# Altium project PMS.PrjPcb
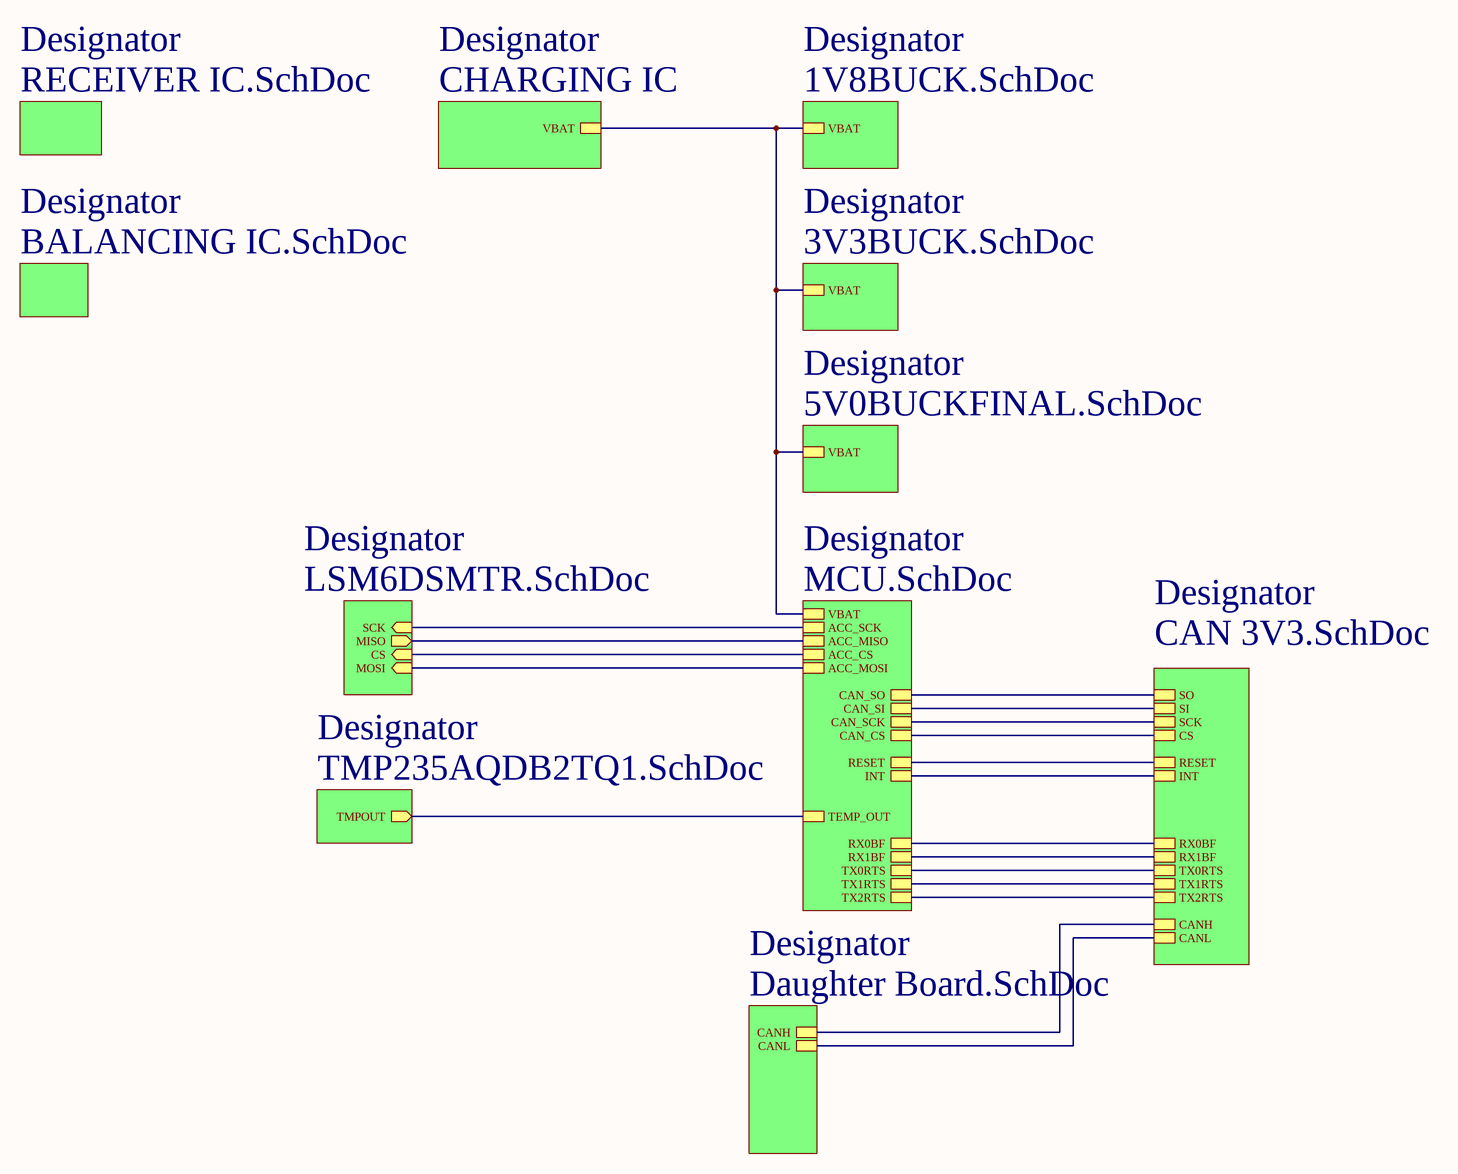
[diagram p0: PMS.SchDoc]
12 sheets, 171 parts. Net scope: hierarchical (ports join the sheet entries above them; power ports are global).
Board file: PMS.PcbDoc
Sheets:
  PMS.SchDoc
    Designator = CHARGING IC.SchDoc
    Designator = BALANCING IC.SchDoc
    Designator = 1V8BUCK.SchDoc
    Designator = 3V3BUCK.SchDoc
    Designator = CAN 3V3.SchDoc
    Designator = RECEIVER IC.SchDoc
    Designator = MCU.SchDoc
    Designator = TMP235AQDB2TQ1.SchDoc
    Designator = LSM6DSMTR.SchDoc
    Designator = 5V0BUCKFINAL.SchDoc
    Designator = Daughter Board.SchDoc

## Sheet PMS.SchDoc
size E

### Sub-sheets
Designator = CHARGING IC: VBAT
Designator = BALANCING IC.SchDoc: no entries
Designator = 1V8BUCK.SchDoc: VBAT
Designator = 3V3BUCK.SchDoc: VBAT
Designator = CAN 3V3.SchDoc: CS, TX2RTS, TX0RTS, TX1RTS, RX0BF, SCK, INT, CANH, RESET, SO, RX1BF, SI, CANL
Designator = RECEIVER IC.SchDoc: no entries
Designator = MCU.SchDoc: CAN_SCK, INT, CAN_CS, ACC_CS, TX2RTS, CAN_SO, TX1RTS, TX0RTS, CAN_SI, ACC_MISO, RX0BF, ACC_SCK, VBAT, ACC_MOSI, TEMP_OUT, RESET, RX1BF
Designator = TMP235AQDB2TQ1.SchDoc: TMPOUT (out)
Designator = LSM6DSMTR.SchDoc: SCK (in), MISO (out), CS (in), MOSI (in)
Designator = 5V0BUCKFINAL.SchDoc: VBAT
Designator = Daughter Board.SchDoc: CANL, CANH

### Nets
NetC41_2: sheet Designator/VBAT, sheet Designator/VBAT, sheet Designator/VBAT, sheet Designator/VBAT, sheet Designator/VBAT
NetC58_2: sheet Designator/CANH, sheet Designator/CANH
NetC67_2: sheet Designator/CANL, sheet Designator/CANL
NetC167_1: sheet Designator/TEMP_OUT, sheet Designator/TMPOUT
NetU7_1: sheet Designator/RESET, sheet Designator/RESET
NetU7_2: sheet Designator/INT, sheet Designator/INT
NetU7_3: sheet Designator/RX0BF, sheet Designator/RX0BF
NetU7_4: sheet Designator/RX1BF, sheet Designator/RX1BF
NetU7_6: sheet Designator/TX0RTS, sheet Designator/TX0RTS
NetU7_7: sheet Designator/TX1RTS, sheet Designator/TX1RTS
NetU7_8: sheet Designator/TX2RTS, sheet Designator/TX2RTS
NetU7_9: sheet Designator/ACC_CS, sheet Designator/CS
NetU7_10: sheet Designator/CS, sheet Designator/CAN_CS
NetU7_18: sheet Designator/SO, sheet Designator/CAN_SO, sheet Designator/ACC_MISO, sheet Designator/MISO
NetU7_19: sheet Designator/SCK, sheet Designator/CAN_SCK, sheet Designator/ACC_SCK, sheet Designator/SCK
NetU7_21: sheet Designator/SI, sheet Designator/CAN_SI, sheet Designator/ACC_MOSI, sheet Designator/MOSI

## Sheet CHARGING IC.SchDoc
size C
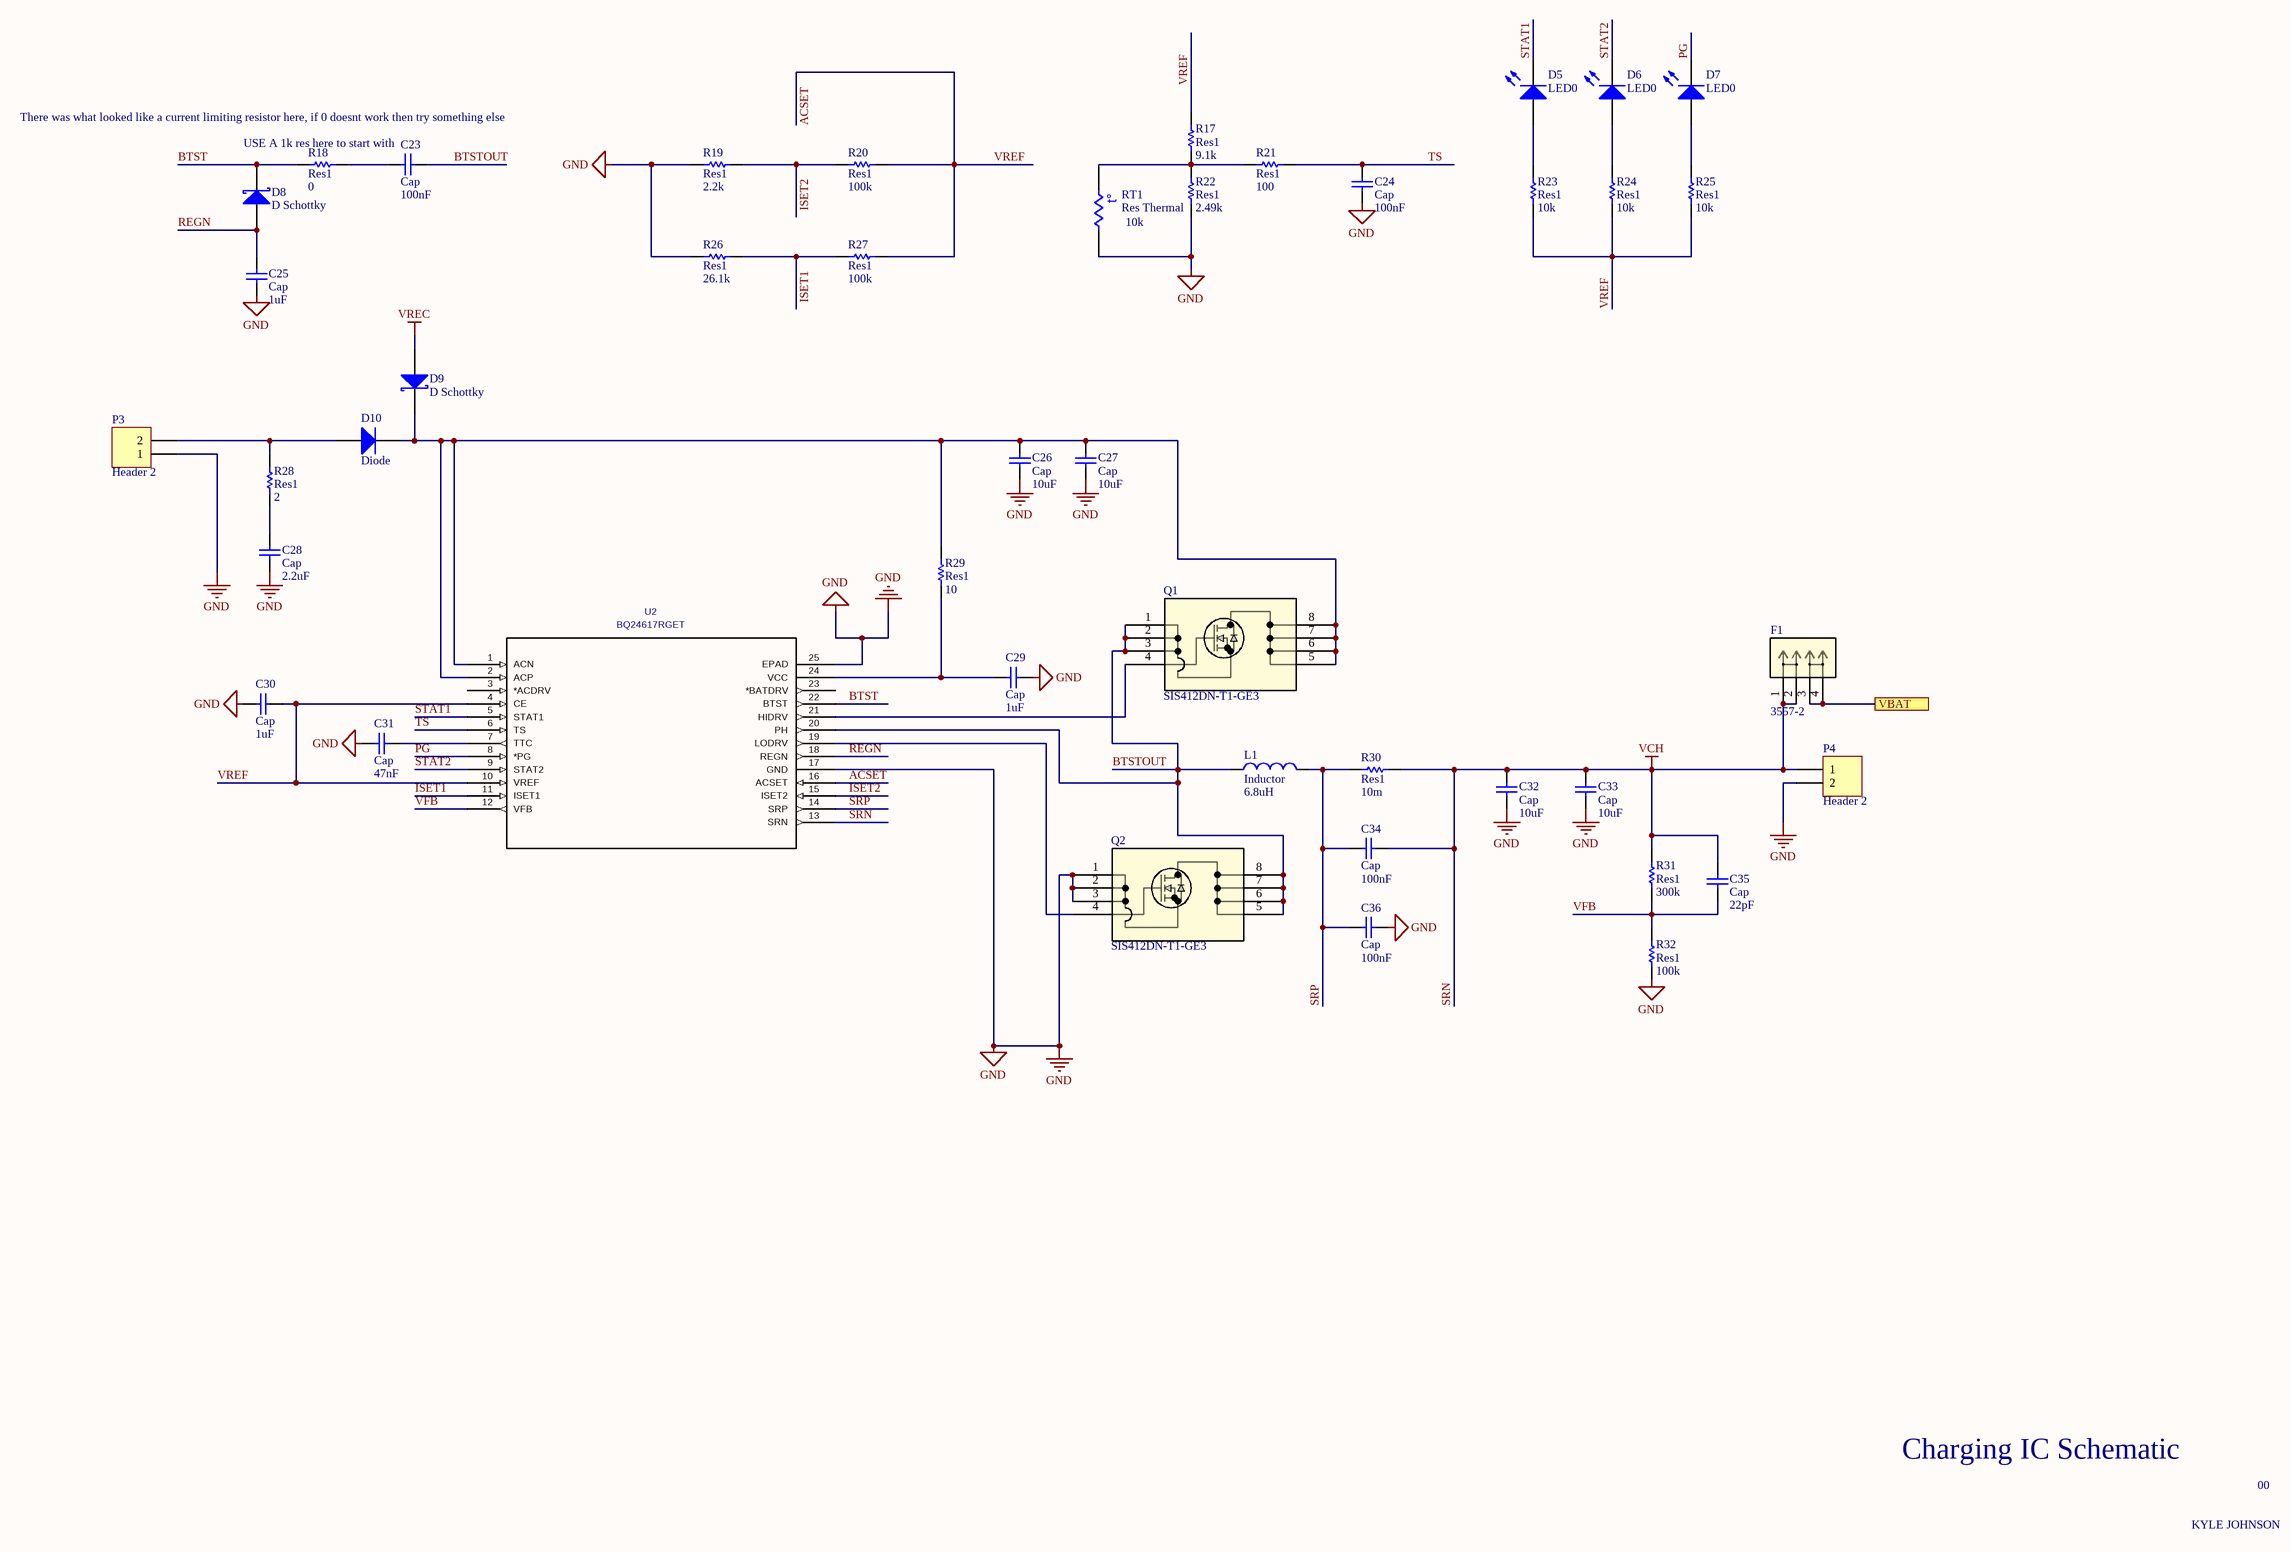
[diagram p1: CHARGING IC.SchDoc]

### Parts
C23  Cap  value 100nF  [0402-A]
C24  Cap  value 100nF  [0402-A]
C25  Cap  value 1uF  [0402-A]
C26  Cap  value 10uF  [6-0805_M]
C27  Cap  value 10uF  [6-0805_M]
C28  Cap  value 2.2uF  [1608[0603]]
C29  Cap  value 1uF  [0402-A]
C30  Cap  value 1uF  [0402-A]
C31  Cap  value 47nF  [0402-A]
C32  Cap  value 10uF  [6-0805_M]
C33  Cap  value 10uF  [6-0805_M]
C34  Cap  value 100nF  [0402-A]
C35  Cap  value 22pF  [0402-A]
C36  Cap  value 100nF  [0402-A]
D5  LED0  [1608[0603]]
D6  LED0  [1608[0603]]
D7  LED0  [1608[0603]]
D8  D Schottky  [425]
D9  D Schottky  [425]
D10  Diode  [X3-WLB1608-2]
F1  3557-2  [CONN_3557-2_KEY]
L1  Inductor  value 6.8uH  [IHLP2525CZER6R8MA1]
P3  Header 2  [2-1445096-2]
P4  Header 2  [2-1445096-2]
Q1  SIS412DN-T1-GE3  [POWERPAK_1212-8]
Q2  SIS412DN-T1-GE3  [POWERPAK_1212-8]
R17  Res1  value 9.1k  [0402-A]
R18  Res1  value 0  [0402-A]
R19  Res1  value 2.2k  [0402-A]
R20  Res1  value 100k  [0402-A]
R21  Res1  value 100  [0402-A]
R22  Res1  value 2.49k  [0402-A]
R23  Res1  value 10k  [0402-A]
R24  Res1  value 10k  [0402-A]
R25  Res1  value 10k  [0402-A]
R26  Res1  value 26.1k  [0402-A]
R27  Res1  value 100k  [0402-A]
R28  Res1  value 2  [6-0805_M]
R29  Res1  value 10  [0402-A]
R30  Res1  value 10m  [6-0805_M]
R31  Res1  value 300k  [0402-A]
R32  Res1  value 100k  [0402-A]
RT1  Res Thermal  value 10k  [1608[0603]]
U2  BQ24617RGET  [RGE24_2P45X2P45]

### Ports
VBAT

### Nets
GND: C24.1 C25.1 C26.1 C27.1 C28.1 C29.2 C30.2 C31.1 C32.1 C33.1 C36.2 P3.1 P4.2 Q2.1(S) Q2.2(S) Q2.3(S) R19.1 R22.1 R26.1 R32.1 RT1.2 U2.17(GND) U2.25(EPAD)
SRN: C32.2 C33.2 C34.1 C35.1 F1.1 F1.2 P4.1 R30.2 R31.2 U2.13(SRN)  [also labelled VCH]
VREC: D9.1(A)
ACSET: C30.1 R17.2 R20.2 R23.1 R24.1 R25.1 R27.2 U2.4(CE) U2.10(VREF) U2.16(ACSET)  [also labelled VREF]
BTST: D8.2(K) R18.1 U2.22(BTST)
BTSTOUT: C23.2 L1.1 Q1.1(S) Q1.2(S) Q1.3(S) Q2.5(D) Q2.6(D) Q2.7(D) Q2.8(D) U2.20(PH)
ISET1: R26.2 R27.1 U2.11(ISET1)
ISET2: R19.2 R20.1 U2.15(ISET2)
PG: D7.2(K) U2.8(*PG)
REGN: C25.2 D8.1(A) U2.18(REGN)
SRP: C34.2 C36.1 L1.2 R30.1 U2.14(SRP)
STAT1: D5.2(K) U2.5(STAT1)
STAT2: D6.2(K) U2.9(STAT2)
TS: C24.2 R21.2 U2.6(TS)
VFB: C35.2 R31.1 R32.2 U2.12(VFB)
NetC23_1: C23.1 R18.2
NetC26_2: C26.2 C27.2 D9.2(K) D10.2(K) Q1.5(D) Q1.6(D) Q1.7(D) Q1.8(D) R29.2 U2.1(ACN) U2.2(ACP)
NetC28_2: C28.2 R28.1
NetC29_1: C29.1 R29.1 U2.24(VCC)
NetC31_2: C31.2 U2.7(TTC)
NetC41_2: F1.3 F1.4 ; port VBAT
NetD5_1: D5.1(A) R23.2
NetD6_1: D6.1(A) R24.2
NetD7_1: D7.1(A) R25.2
NetD10_1: D10.1(A) P3.2 R28.2
NetQ1_4: Q1.4(G) U2.21(HIDRV)
NetQ2_4: Q2.4(G) U2.19(LODRV)
NetR17_1: R17.1 R21.1 R22.2 RT1.1

Not connected (* = marked no-connect by the designer): U2 3(*ACDRV) 23(*BATDRV)

### Notes on the sheet
- There was what looked like a current limiting resistor here, if 0 doesnt work then try something else
- USE A 1k res here to start with
- Charging IC Schematic
- KYLE JOHNSON
- 00
- (in symbol Res Thermal) t°

### Library data of the parts
C23-C36 = Cap: Capacitor; Published: 8-Jun-2000; LatestRevisionDate: 17-Jul-2002; LatestRevisionNote: Re-released for DXP Platform.; PackageReference: RAD-0.3; Publisher: Altium Limited; PackageDescription: Radial Cap, Thru-Hole; 2 Leads; 0.3 in Pin Spacing
D8 D9 = D Schottky: Schottky Diode; Published: 8-Jun-2000; LatestRevisionDate: 17-Jul-2002; LatestRevisionNote: Re-released for DXP Platform.; PackageReference: SMB; Publisher: Altium Limited; PackageDescription: DO-214-AA/SMB; 2 C-Bend Leads; Body 5.3 x 3.6 mm, inc. leads (LxW); Code_JEDEC: DO-214-AA
D10 = Diode: Default Diode; Published: 8-Jun-2000; LatestRevisionDate: 17-Jul-2002; LatestRevisionNote: Re-released for DXP Platform.; PackageVersion: Sep-1996; PackageReference: SMC; Publisher: Altium Limited; PackageDescription: DO-214-AB/SMC; 2 C-Bend Leads; Body 7.9 x 5.9 mm, inc. leads (LxW); Code_JEDEC: DO-214-AB
F1 = 3557-2: No Description Available; Vendor: Keystone Electronics; Built_By: EMA_Cory; SourceLibrary: Keystone Electronics_Complete_2020-01-22; Type: DEV; Manufacturer_Part_Number: 3557-2; Copyright: Copyright (C) 2018 Accelerated Designs. All rights reserved; RefDes: RefDes
L1 = Inductor: Code_IEC: 1005; Published: 8-Jun-2000; LatestRevisionDate: 29-May-2009; LatestRevisionNote: IPC-7351 Footprint Added.; PackageReference: 0402-A; Publisher: Altium Limited; PackageDescription: Chip Inductor; Code_JEITA: 0402
P3 P4 = Header 2: Header, 2-Pin; LatestRevisionDate: 17-Jul-2002; LatestRevisionNote: Re-released for DXP Platform.; Publisher: Altium Limited
Q1 Q2 = SIS412DN-T1-GE3: No Description Available; Vendor: Vishay; Built_By: EMA_Cory; Type: DEV; Datasheet: https://www.vishay.com/docs/69006/sis412dn.pdf; Manufacturer_Part_Number: SIS412DN-T1-GE3; Copyright: Copyright (C) 2018 Accelerated Designs. All rights reserved; RefDes: RefDes
R17-R32 = Res1: Resistor; Published: 8-Jun-2000; LatestRevisionDate: 17-Jul-2002; LatestRevisionNote: Re-released for DXP Platform.; PackageReference: AXIAL-0.3; Publisher: Altium Limited; PackageDescription: Axial Device, Thru-Hole; 2 Leads; 0.3 in Pin Spacing
RT1 = Res Thermal: Thermistor; Published: 24-Mar-1999; LatestRevisionDate: 29-May-2009; LatestRevisionNote: IPC-7351 Footprint Added.; PackageVersion: Mar-2003; PackageReference: 6-0805; Publisher: Altium Limited; PackageDescription: Chip Resistor 0805 Case Size; Code_IPC: RESC2012
U2 = BQ24617RGET: Manufacturer: Texas Instruments; C: Copyright (C) 2015 Accelerated Designs. All rights reserved; Built_By: EMA_UL_Team; Value: BQ24617RGET; Vendor: Vendor; Manufacturer_Part_Number: BQ24617RGET
D5-D7 = LED0: Published: 8-Jun-2000; LatestRevisionDate: 08-Jul-2005; LatestRevisionNote: Mech Layer 1 removed.; PackageReference: LED-0; Publisher: Altium Limited; PackageDescription: LED; 2 Leads

## Sheet BALANCING IC.SchDoc
size A
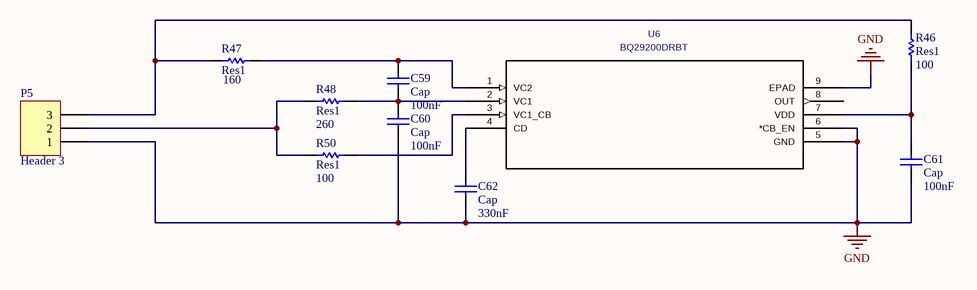
[diagram p2: BALANCING IC.SchDoc]

### Parts
C59  Cap  value 100nF  [0402-A]
C60  Cap  value 100nF  [0402-A]
C61  Cap  value 100nF  [0402-A]
C62  Cap  value 330nF  [6-0805_M]
P5  Header 3  [conn3_2-1445050-3_TEC]
R46  Res1  value 100  [0402-A]
R47  Res1  value 160  [0402-A]
R48  Res1  value 260  [0402-A]
R50  Res1  value 100  [0402-A]
U6  BQ29200DRBT  [DRB8_1P6X2P4]

### Nets
GND: C60.1 C61.2 C62.1 P5.1 U6.5(GND) U6.6(*CB_EN) U6.9(EPAD)
NetC59_1: C59.1 R47.2 U6.1(VC2)
NetC59_2: C59.2 C60.2 R48.2 U6.2(VC1)
NetC61_1: C61.1 R46.2 U6.7(VDD)
NetC62_2: C62.2 U6.4(CD)
NetP5_2: P5.2 R48.1 R50.1
NetP5_3: P5.3 R46.1 R47.1
NetR50_2: R50.2 U6.3(VC1_CB)

Not connected (* = marked no-connect by the designer): U6 8(OUT)

### Library data of the parts
C59-C62 = Cap: Capacitor; Published: 8-Jun-2000; LatestRevisionDate: 17-Jul-2002; LatestRevisionNote: Re-released for DXP Platform.; PackageReference: RAD-0.3; Publisher: Altium Limited; PackageDescription: Radial Cap, Thru-Hole; 2 Leads; 0.3 in Pin Spacing
P5 = Header 3: Header, 3-Pin; LatestRevisionDate: 17-Jul-2002; LatestRevisionNote: Re-released for DXP Platform.; Publisher: Altium Limited
R46-R48 R50 = Res1: Resistor; Published: 8-Jun-2000; LatestRevisionDate: 17-Jul-2002; LatestRevisionNote: Re-released for DXP Platform.; PackageReference: AXIAL-0.3; Publisher: Altium Limited; PackageDescription: Axial Device, Thru-Hole; 2 Leads; 0.3 in Pin Spacing
U6 = BQ29200DRBT: Manufacturer: Texas Instruments; C: Copyright (C) 2015 Accelerated Designs. All rights reserved; Built_By: EMA_UL_Team; Value: BQ29200DRBT; Vendor: Vendor; Manufacturer_Part_Number: BQ29200DRBT

## Sheet 1V8BUCK.SchDoc
size A
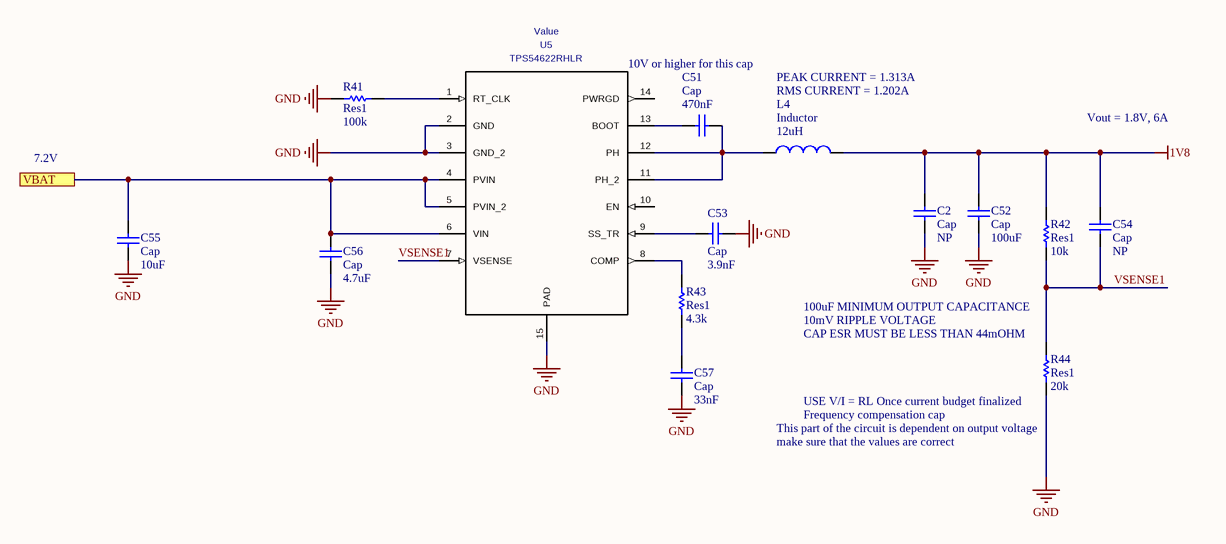
[diagram p3: 1V8BUCK.SchDoc]

### Parts
C2  Cap  value NP  [1608[0603]]
C51  Cap  value 470nF  [0402-A]
C52  Cap  value 100uF  [C1210]
C53  Cap  value 3.9nF  [0402-A]
C54  Cap  value NP  [1608[0603]]
C55  Cap  value 10uF  [6-0805_M]
C56  Cap  value 4.7uF  [6-0805_M]
C57  Cap  value 33nF  [0402-A]
L4  Inductor  value 12uH  [IND_BOURNS_SRR1260]
R41  Res1  value 100k  [0402-A]
R42  Res1  value 10k  [0402-A]
R43  Res1  value 4.3k  [0402-A]
R44  Res1  value 20k  [0402-A]
U5  TPS54622RHLR  [RHL0014A]

### Ports
VBAT

### Nets
1V8: C2.2 C52.2 C54.2 L4.2 R42.1
GND: C2.1 C52.1 C53.1 C55.1 C56.1 C57.1 R41.1 R44.1 U5.2(GND) U5.3(GND_2) U5.15(PAD)
VSENSE1: C54.1 R42.2 R44.2 U5.7(VSENSE)
NetC41_2: C55.2 C56.2 U5.4(PVIN) U5.5(PVIN_2) U5.6(VIN) ; port VBAT
NetC51_1: C51.1 U5.13(BOOT)
NetC51_2: C51.2 L4.1 U5.11(PH_2) U5.12(PH)
NetC53_2: C53.2 U5.9(SS_TR)
NetC57_2: C57.2 R43.1
NetR41_2: R41.2 U5.1(RT_CLK)
NetR43_2: R43.2 U5.8(COMP)

Not connected (* = marked no-connect by the designer): U5 10(EN) 14(PWRGD)

### Notes on the sheet
- (near U5) 10V or higher for this cap
- PEAK CURRENT = 1.313A
- RMS CURRENT = 1.202A
- Vout = 1.8V, 6A
- 7.2V
- 100uF MINIMUM OUTPUT CAPACITANCE
- 10mV RIPPLE VOLTAGE
- (near R44) CAP ESR MUST BE LESS THAN 44mOHM
- (near R44) USE V/I = RL Once current budget finalized
- Frequency compensation cap
- (near R44) This part of the circuit is dependent on output voltage
- make sure that the values are correct

### Library data of the parts
C2 C51-C57 = Cap: Capacitor; Published: 8-Jun-2000; LatestRevisionDate: 17-Jul-2002; LatestRevisionNote: Re-released for DXP Platform.; PackageReference: RAD-0.3; Publisher: Altium Limited; PackageDescription: Radial Cap, Thru-Hole; 2 Leads; 0.3 in Pin Spacing
L4 = Inductor: Code_IEC: 1005; Published: 8-Jun-2000; LatestRevisionDate: 29-May-2009; LatestRevisionNote: IPC-7351 Footprint Added.; PackageReference: 0402-A; Publisher: Altium Limited; PackageDescription: Chip Inductor; Code_JEITA: 0402
R41-R44 = Res1: Resistor; Published: 8-Jun-2000; LatestRevisionDate: 17-Jul-2002; LatestRevisionNote: Re-released for DXP Platform.; PackageReference: AXIAL-0.3; Publisher: Altium Limited; PackageDescription: Axial Device, Thru-Hole; 2 Leads; 0.3 in Pin Spacing
U5 = TPS54622RHLR: Manufacturer: Texas Instruments; CompType: IC; PIN_COUNT: 15; PartNumber: TPS54622RHLR; PackageReference: RHL0014A; MountType: SMT; RoHS: Y; Value: Value

## Sheet 3V3BUCK.SchDoc
size A
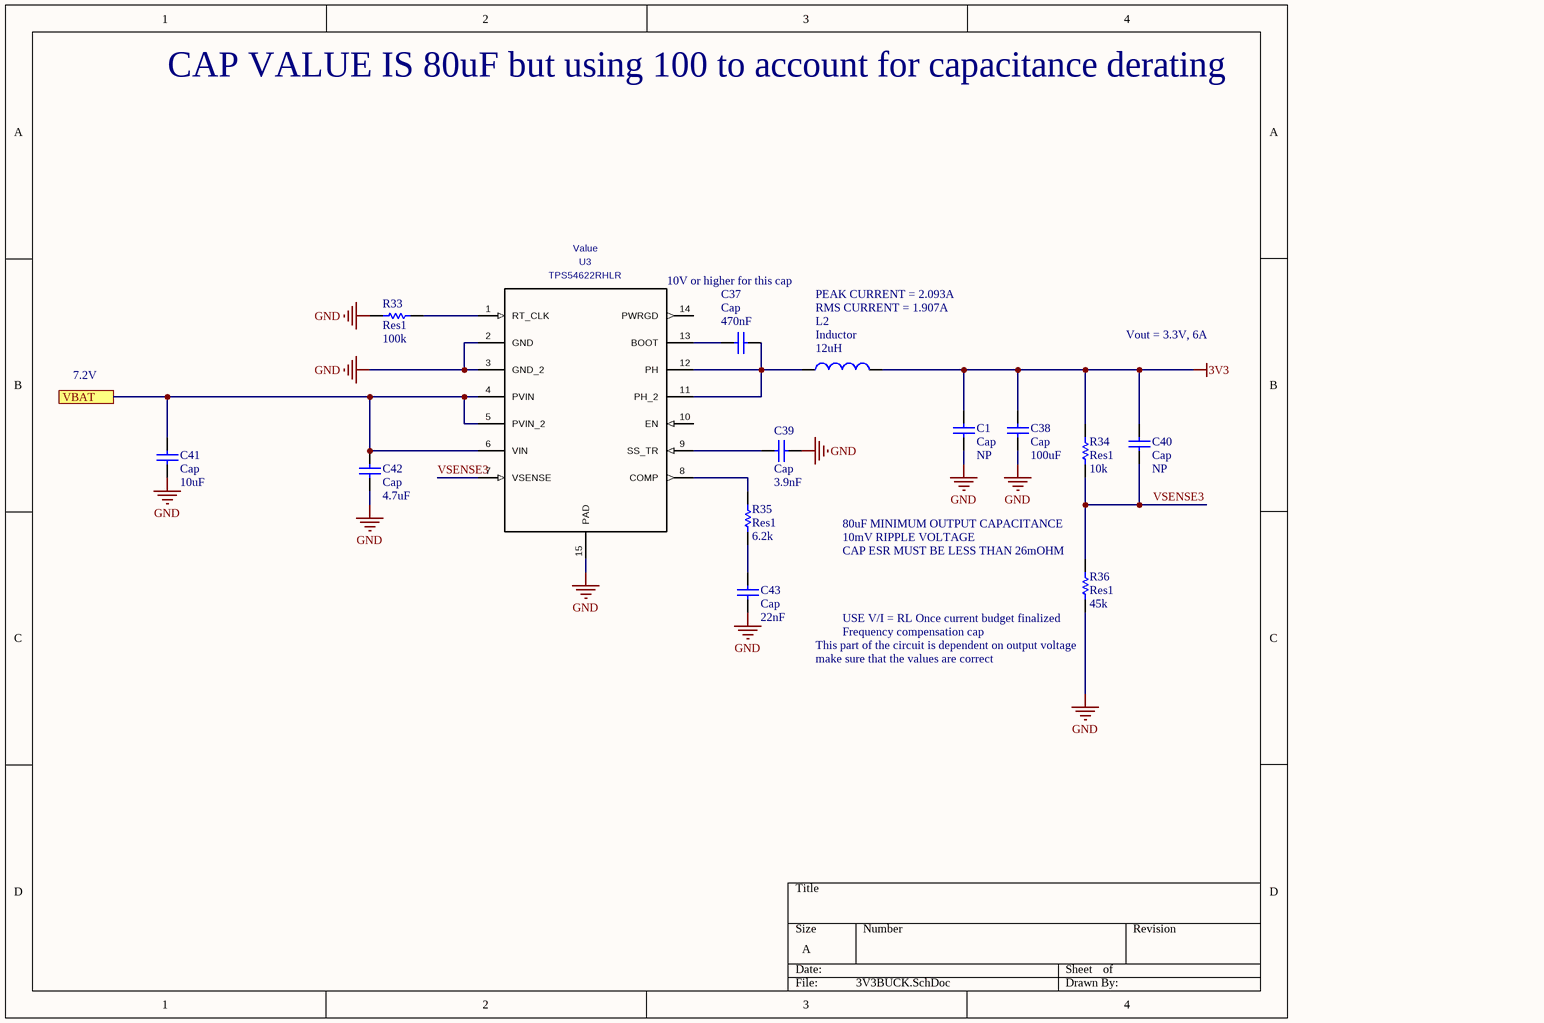
[diagram p4: 3V3BUCK.SchDoc]

### Parts
C1  Cap  value NP  [1608[0603]]
C37  Cap  value 470nF  [0402-A]
C38  Cap  value 100uF  [C1210]
C39  Cap  value 3.9nF  [0402-A]
C40  Cap  value NP  [1608[0603]]
C41  Cap  value 10uF  [6-0805_M]
C42  Cap  value 4.7uF  [6-0805_M]
C43  Cap  value 22nF  [0402-A]
L2  Inductor  value 12uH  [IND_BOURNS_SRR1260]
R33  Res1  value 100k  [0402-A]
R34  Res1  value 10k  [0402-A]
R35  Res1  value 6.2k  [0402-A]
R36  Res1  value 45k  [0402-A]
U3  TPS54622RHLR  [RHL0014A]

### Ports
VBAT

### Nets
3V3: C1.2 C38.2 C40.2 L2.2 R34.1
GND: C1.1 C38.1 C39.1 C41.1 C42.1 C43.1 R33.1 R36.1 U3.2(GND) U3.3(GND_2) U3.15(PAD)
VSENSE3: C40.1 R34.2 R36.2 U3.7(VSENSE)
NetC37_1: C37.1 U3.13(BOOT)
NetC37_2: C37.2 L2.1 U3.11(PH_2) U3.12(PH)
NetC39_2: C39.2 U3.9(SS_TR)
NetC41_2: C41.2 C42.2 U3.4(PVIN) U3.5(PVIN_2) U3.6(VIN) ; port VBAT
NetC43_2: C43.2 R35.1
NetR33_2: R33.2 U3.1(RT_CLK)
NetR35_2: R35.2 U3.8(COMP)

Not connected (* = marked no-connect by the designer): U3 10(EN) 14(PWRGD)

### Notes on the sheet
- CAP VALUE IS 80uF but using 100 to account for capacitance derating
- (near U3) 10V or higher for this cap
- PEAK CURRENT = 2.093A
- RMS CURRENT = 1.907A
- Vout = 3.3V, 6A
- 7.2V
- 80uF MINIMUM OUTPUT CAPACITANCE
- 10mV RIPPLE VOLTAGE
- (near R36) CAP ESR MUST BE LESS THAN 26mOHM
- (near R36) USE V/I = RL Once current budget finalized
- Frequency compensation cap
- (near R36) This part of the circuit is dependent on output voltage
- make sure that the values are correct

### Library data of the parts
C1 C37-C43 = Cap: Capacitor; Published: 8-Jun-2000; LatestRevisionDate: 17-Jul-2002; LatestRevisionNote: Re-released for DXP Platform.; PackageReference: RAD-0.3; Publisher: Altium Limited; PackageDescription: Radial Cap, Thru-Hole; 2 Leads; 0.3 in Pin Spacing
L2 = Inductor: Code_IEC: 1005; Published: 8-Jun-2000; LatestRevisionDate: 29-May-2009; LatestRevisionNote: IPC-7351 Footprint Added.; PackageReference: 0402-A; Publisher: Altium Limited; PackageDescription: Chip Inductor; Code_JEITA: 0402
R33-R35 = Res1: Resistor; Published: 8-Jun-2000; LatestRevisionDate: 17-Jul-2002; LatestRevisionNote: Re-released for DXP Platform.; PackageReference: AXIAL-0.3; Publisher: Altium Limited; PackageDescription: Axial Device, Thru-Hole; 2 Leads; 0.3 in Pin Spacing
R36 = Res1: Resistor 1%; Published: 8-Jun-2000; LatestRevisionDate: 17-Jul-2002; LatestRevisionNote: Re-released for DXP Platform.; PackageReference: AXIAL-0.3; Publisher: Altium Limited; PackageDescription: Axial Device, Thru-Hole; 2 Leads; 0.3 in Pin Spacing
U3 = TPS54622RHLR: as U5 on sheet 1V8BUCK; PartNumber: TPS54622RHLR; PackageReference: RHL0014A; MountType: SMT; RoHS: Y; Value: Value

## Sheet CAN 3V3.SchDoc
size A
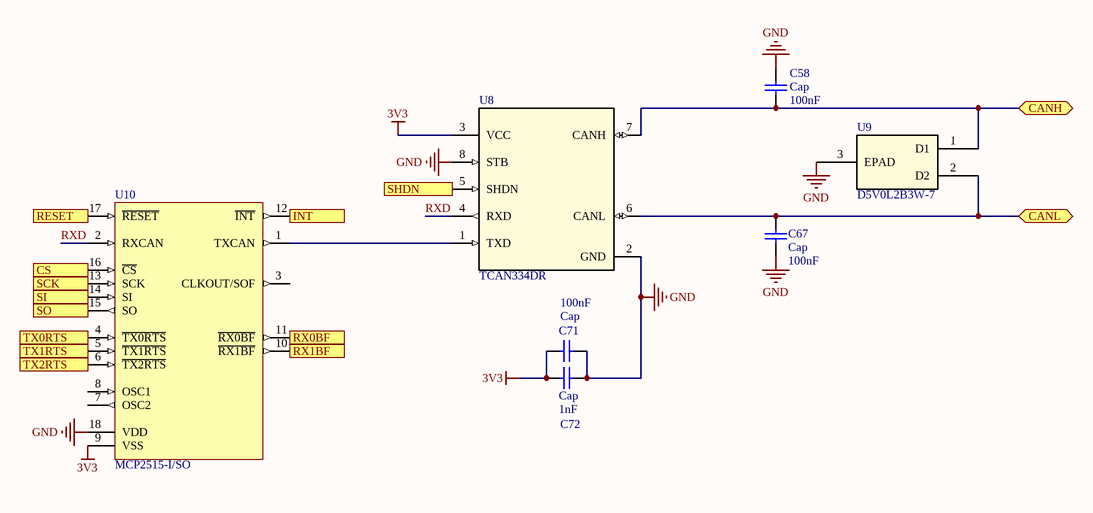
[diagram p5: CAN 3V3.SchDoc]

### Parts
C58  Cap  value 100nF  [1608[0603]]
C67  Cap  value 100nF  [1608[0603]]
C71  Cap  value 100nF  [1608[0603]]
C72  Cap  value 1nF  [1608[0603]]
U8  TCAN334DR  [D0008A_N]
U9  D5V0L2B3W-7  [SOT-323_DIO]
U10  MCP2515-I/SO  [SOIC-SO18_L]

### Ports
CANH (bidir), CANL (bidir), CS (in), INT (out), RESET (in), RX0BF (out), RX1BF (out), SCK (in), SHDN (in), SI (in), SO (out), TX0RTS (in), TX1RTS (in), TX2RTS (in)

### Nets
3V3: C71.1 C72.2 U8.3(VCC) U10.9(VSS)
GND: C58.1 C67.1 C71.2 C72.1 U8.2(GND) U8.8(STB) U9.3(EPAD) U10.18(VDD)
RXD: U8.4(RXD) U10.2(RXCAN)
NetC58_2: C58.2 U8.7(CANH) U9.1(D1) ; port CANH
NetC67_2: C67.2 U8.6(CANL) U9.2(D2) ; port CANL
NetU7_1: U10.17(~{RESET}) ; port RESET
NetU7_2: U10.12(~{INT}) ; port INT
NetU7_3: U10.11(~{RX0BF}) ; port RX0BF
NetU7_4: U10.10(~{RX1BF}) ; port RX1BF
NetU7_6: U10.4(~{TX0RTS}) ; port TX0RTS
NetU7_7: U10.5(~{TX1RTS}) ; port TX1RTS
NetU7_8: U10.6(~{TX2RTS}) ; port TX2RTS
NetU7_10: U10.16(~{CS}) ; port CS
NetU7_18: U10.15(SO) ; port SO
NetU7_19: U10.13(SCK) ; port SCK
NetU7_21: U10.14(SI) ; port SI
NetU8_1: U8.1(TXD) U10.1(TXCAN)
NetU8_5: U8.5(SHDN) ; port SHDN

Not connected (* = marked no-connect by the designer): U10 3(CLKOUT/SOF) 7(OSC2) 8(OSC1)

### Library data of the parts
C58 C67 C71 C72 = Cap: Capacitor; Published: 8-Jun-2000; LatestRevisionDate: 17-Jul-2002; LatestRevisionNote: Re-released for DXP Platform.; PackageReference: RAD-0.3; Publisher: Altium Limited; PackageDescription: Radial Cap, Thru-Hole; 2 Leads; 0.3 in Pin Spacing
U8 = TCAN334DR: No Description Available; Manufacturer: Texas Instruments; PartNumber: TCAN334DR; RefDes: RefDes; Type: DEV; Value: Value; Copyright: Copyright (C) 2018 Accelerated Designs. All rights reserved
U9 = D5V0L2B3W-7: No Description Available; Vendor: Diodes Inc; Built_By: EMA_UL_Team; SourceLibrary: DIODESINC_2_2015-08-18; Manufacturer_Part_Number: D5V0L2B3W-7; Copyright: Copyright (C) 2018 Accelerated Designs. All rights reserved; RefDes: RefDes; Type: DEV
U10 = CMP-0186-00133-2: Stand-Alone CAN Controller With SPI Interface, 18-Pin SOIC, Industrial Temperature; ComponentLink2Description: Datasheet; RevisionNote: URLs added. DatasheetVersion updated.; PackageVersion: revBB, Aug-2009; ComponentLink1URL: http://www.microchip.com/; PackageReference: SOIC-SO18; PackageDescription: 18-Lead Plastic Small Outline (SO) - Wide 7.50mm Body [SOIC]; DatasheetVersion: revF, Oct-2010; ComponentLink2URL: http://ww1.microchip.com/downloads/en/DeviceDoc/21801f.pdf; ComponentLink3URL: http://www.microchip.com/stellent/groups/techpub_sg/documents/packagingspec/en012702.pdf; Code_JEDEC: MS-013; ComponentLink3Description: Package Specification; ComponentLink1Description: Manufacturer URL

## Sheet RECEIVER IC.SchDoc
size D
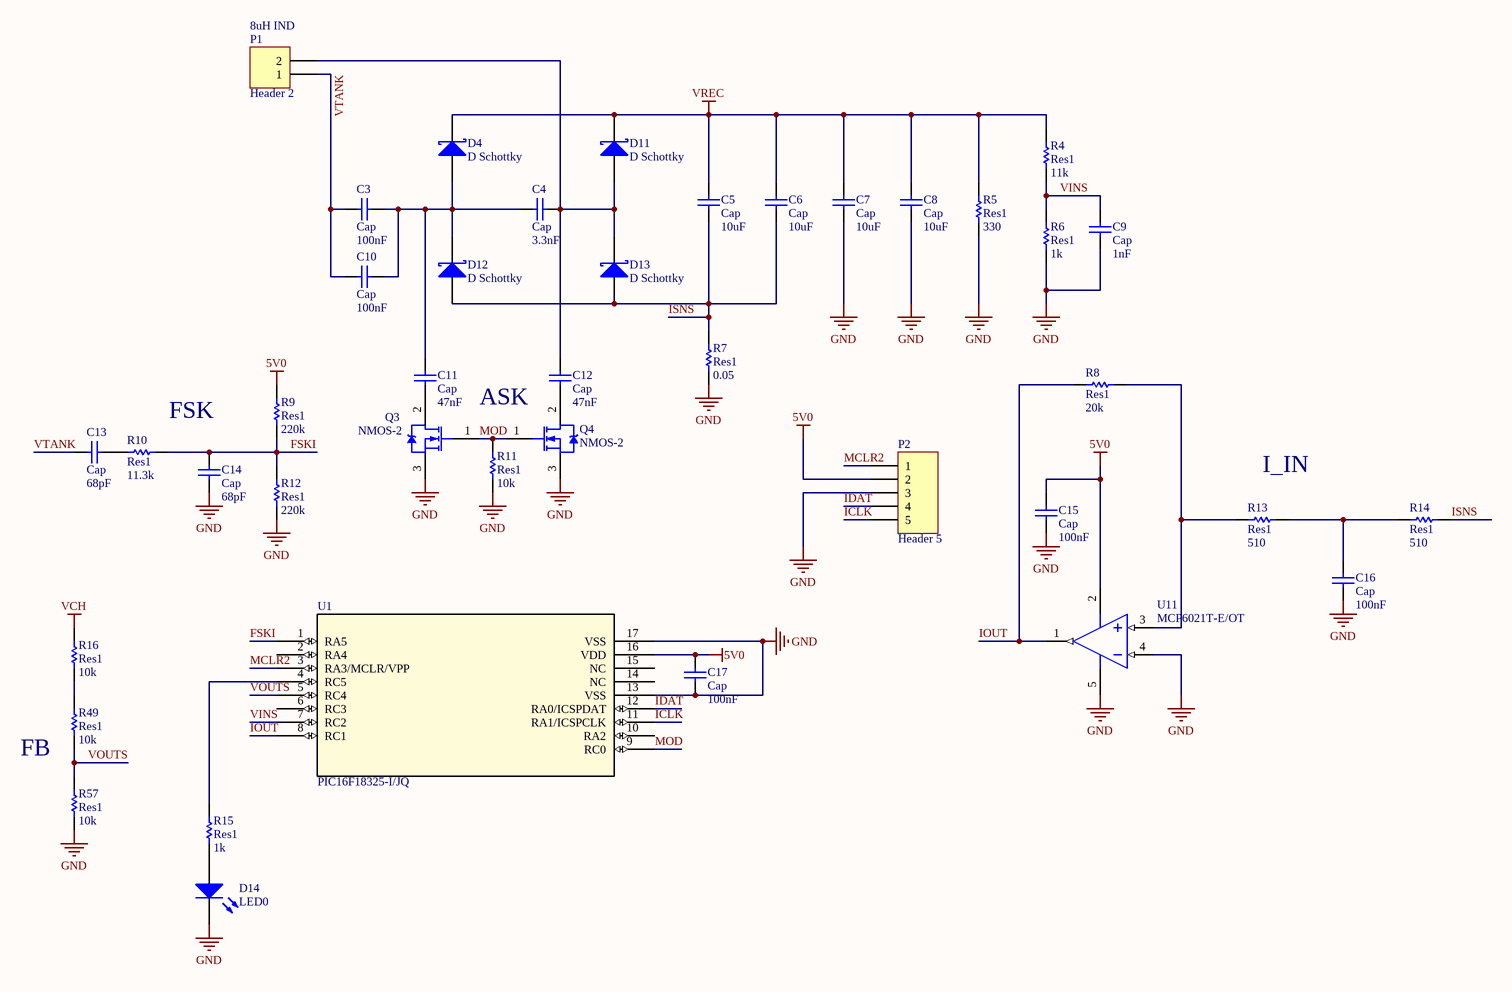
[diagram p6: RECEIVER IC.SchDoc]

### Parts
C3  Cap  value 100nF  [C1206]
C4  Cap  value 3.3nF  [6-0805_M]
C5  Cap  value 10uF  [C1210]
C6  Cap  value 10uF  [C1210]
C7  Cap  value 10uF  [C1210]
C8  Cap  value 10uF  [C1210]
C9  Cap  value 1nF  [1608[0603]]
C10  Cap  value 100nF  [C1206]
C11  Cap  value 47nF  [6-0805_M]
C12  Cap  value 47nF  [6-0805_M]
C13  Cap  value 68pF  [1608[0603]]
C14  Cap  value 68pF  [1608[0603]]
C15  Cap  value 100nF  [1608[0603]]
C16  Cap  value 100nF  [1608[0603]]
C17  Cap  value 100nF  [1608[0603]]
D4  D Schottky  [DIO_RB050LAM_ROM]
D11  D Schottky  [DIO_RB050LAM_ROM]
D12  D Schottky  [DIO_RB050LAM_ROM]
D13  D Schottky  [DIO_RB050LAM_ROM]
D14  LED0  [1608[0603]]
P1  Header 2  [2-1445096-2]
P2  Header 5  [HDR1X5]
Q3  NMOS-2  [SOT-23_M]
Q4  NMOS-2  [SOT-23_M]
R4  Res1  value 11k  [1608[0603]]
R5  Res1  value 330  [C1206]
R6  Res1  value 1k  [1608[0603]]
R7  Res1  value 0.05  [C1206]
R8  Res1  value 20k  [1608[0603]]
R9  Res1  value 220k  [1608[0603]]
R10  Res1  value 11.3k  [1608[0603]]
R11  Res1  value 10k  [1608[0603]]
R12  Res1  value 220k  [1608[0603]]
R13  Res1  value 510  [1608[0603]]
R14  Res1  value 510  [1608[0603]]
R15  Res1  value 1k  [1608[0603]]
R16  Res1  value 10k  [1608[0603]]
R49  Res1  value 10k  [1608[0603]]
R57  Res1  value 10k  [1608[0603]]
U1  PIC16F18325-I/JQ  [UQFN16_JQ_MCH]
U11  MCP6021T-E/OT  [SOT-23-OT5_N]

### Nets
5V0: C15.2 C17.2 P2.2 R9.2 U1.16(VDD) U11.2(VSS)
GND: C7.1 C8.1 C9.1 C14.1 C15.1 C16.1 C17.1 D14.2(K) P2.3 Q3.3(S) Q4.3(S) R5.1 R6.1 R7.1 R11.1 R12.1 R57.1 U1.13(VSS) U1.17(VSS) U11.4(VIN-) U11.5(VDD)
VCH: R16.2  [project net SRN]
VREC: C5.2 C6.2 C7.2 C8.2 D4.2(K) D11.2(K) R4.2 R5.2
FSKI: C14.2 R9.1 R10.2 R12.2 U1.1(RA5)
ICLK: P2.5 U1.11(RA1/ICSPCLK)
IDAT: P2.4 U1.12(RA0/ICSPDAT)
IOUT: R8.1 U1.8(RC1) U11.1(VOUT)
ISNS: C5.1 C6.1 D12.1(A) D13.1(A) R7.2 R14.2
MCLR2: P2.1 U1.3(RA3/MCLR/VPP)
MOD: Q3.1(G) Q4.1(G) R11.2 U1.9(RC0)
VINS: C9.2 R4.1 R6.2 U1.7(RC2)
VOUTS: R49.1 R57.2 U1.5(RC4)
VTANK: C3.1 C10.1 C13.1 P1.1
NetC3_2: C3.2 C4.1 C10.2 C11.2 D4.1(A) D12.2(K)
NetC4_2: C4.2 C12.2 D11.1(A) D13.2(K) P1.2
NetC11_1: C11.1 Q3.2(D)
NetC12_1: C12.1 Q4.2(D)
NetC13_2: C13.2 R10.1
NetC16_2: C16.2 R13.2 R14.1
NetD14_1: D14.1(A) R15.1
NetR8_2: R8.2 R13.1 U11.3(VIN+)
NetR15_2: R15.2 U1.4(RC5)
NetR16_1: R16.1 R49.2

Not connected (* = marked no-connect by the designer): U1 2(RA4) 6(RC3) 10(RA2) 14(NC) 15(NC)

### Notes on the sheet
- (near P1) 8uH IND
- ASK
- FSK
- (near R13) I_IN
- FB

### Library data of the parts
C3-C17 = Cap: Capacitor; Published: 8-Jun-2000; LatestRevisionDate: 17-Jul-2002; LatestRevisionNote: Re-released for DXP Platform.; PackageReference: RAD-0.3; Publisher: Altium Limited; PackageDescription: Radial Cap, Thru-Hole; 2 Leads; 0.3 in Pin Spacing
D4 D11-D13 = D Schottky: Schottky Diode; Published: 8-Jun-2000; LatestRevisionDate: 17-Jul-2002; LatestRevisionNote: Re-released for DXP Platform.; PackageReference: SMB; Publisher: Altium Limited; PackageDescription: DO-214-AA/SMB; 2 C-Bend Leads; Body 5.3 x 3.6 mm, inc. leads (LxW); Code_JEDEC: DO-214-AA
D14 = LED0: Typical INFRARED GaAs LED; Published: 8-Jun-2000; LatestRevisionDate: 08-Jul-2005; LatestRevisionNote: Mech Layer 1 removed.; PackageReference: LED-0; Publisher: Altium Limited; PackageDescription: LED; 2 Leads
P1 = Header 2: Header, 2-Pin; LatestRevisionDate: 17-Jul-2002; LatestRevisionNote: Re-released for DXP Platform.; Publisher: Altium Limited
P2 = Header 5: Header, 5-Pin; LatestRevisionDate: 17-Jul-2002; LatestRevisionNote: Re-released for DXP Platform.; Publisher: Altium Limited
Q3 Q4 = NMOS-2: N-Channel Power MOSFET; Note: Pin 2 is electrically connected to pin 4.; Published: 8-Jun-2000; LatestRevisionDate: 17-Jul-2002; LatestRevisionNote: Re-released for DXP Platform.; DatasheetVersion: PD-9.814; PackageVersion: Feb-1997; PackageReference: TO-220AB; Publisher: Altium Limited; PackageDescription: TO, Thru-Hole, Vertical, Heatsink Mounted; 3 In-Line Leads; Pitch 2.54 mm; ComponentLink1Description: Manufacturer Link; ComponentLink1URL: http://www.irf.com/
R4-R16 R49 R57 = Res1: Resistor; Published: 8-Jun-2000; LatestRevisionDate: 17-Jul-2002; LatestRevisionNote: Re-released for DXP Platform.; PackageReference: AXIAL-0.3; Publisher: Altium Limited; PackageDescription: Axial Device, Thru-Hole; 2 Leads; 0.3 in Pin Spacing
U1 = PIC16F18325-I/JQ: No Description Available; Vendor: Microchip; Built_By: EMA_Cory; SourceLibrary: Add_to_database_2020-10-27; Datasheet: https://ww1.microchip.com/downloads/en/DeviceDoc/PIC16-L-F18325-18345-Data-Sheet-40001795H.pdf; Manufacturer_Part_Number: PIC16F18325-I/JQ; Copyright: Copyright (C) 2018 Accelerated Designs. All rights reserved; RefDes: RefDes; Type: DEV
U11 = CMP-0187-00449-2: Rail-to-Rail Input/Output, 10 MHz Operational Amplifier, 5-Pin SOT-23, Extended Temperature, Tape and Reel; ComponentLink1Description: Manufacturer URL; ComponentLink3URL: http://www.microchip.com/stellent/groups/techpub_sg/documents/packagingspec/en012702.pdf; PackageVersion: revBB, Aug-2009; PackageReference: SOT-23-OT5; DatasheetVersion: revD, Feb-2009; ComponentLink2Description: Datasheet; PackageDescription: 5-Lead Plastic Small Outline Transistor (OT) [SOT-23]; Code_IPC: SOT23-5; ComponentLink2URL: http://ww1.microchip.com/downloads/en/DeviceDoc/21685d.pdf; ComponentLink3Description: Package Specification; RevisionNote: URLs added.; ComponentLink1URL: http://www.microchip.com/

## Sheet MCU.SchDoc
size A
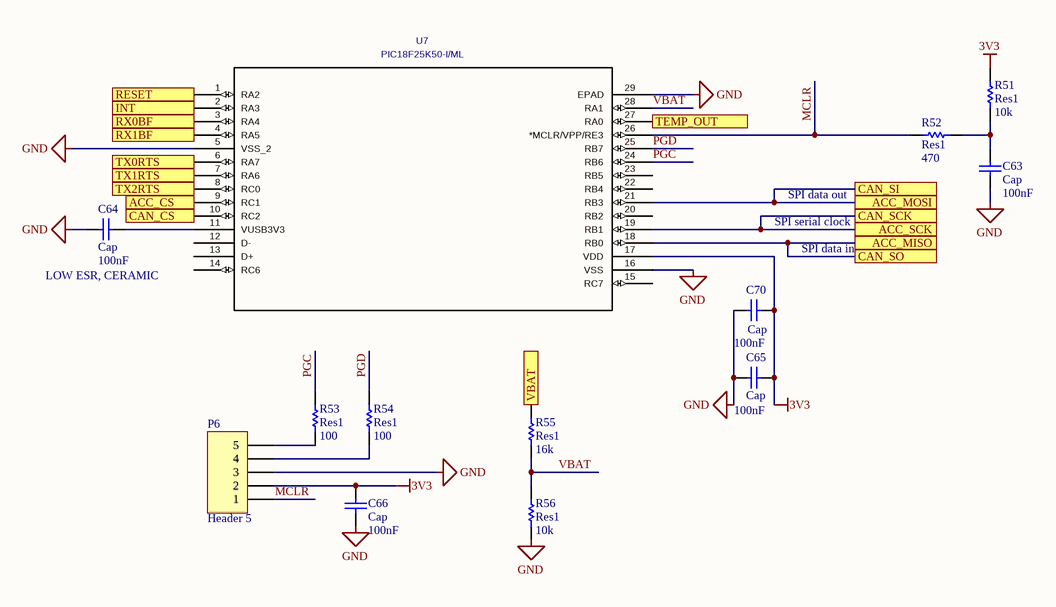
[diagram p7: MCU.SchDoc]

### Parts
C63  Cap  value 100nF  [0402-A]
C64  Cap  value 100nF  [0402-A]
C65  Cap  value 100nF  [0402-A]
C66  Cap  value 100nF  [0402-A]
C70  Cap  value 100nF  [0402-A]
P6  Header 5  [HDR1X5]
R51  Res1  value 10k  [0402-A]
R52  Res1  value 470  [0402-A]
R53  Res1  value 100  [0402-A]
R54  Res1  value 100  [0402-A]
R55  Res1  value 16k  [0402-A]
R56  Res1  value 10k  [0402-A]
U7  PIC18F25K50-I/ML  [QFN28_6X6MC_MCH]

### Ports
ACC_CS, ACC_MISO, ACC_MOSI, ACC_SCK, CAN_CS, CAN_SCK, CAN_SI, CAN_SO, INT, RESET, RX0BF, RX1BF, TEMP_OUT, TX0RTS, TX1RTS, TX2RTS, VBAT

### Nets
3V3: C65.2 C66.2 C70.2 P6.2 R51.2 U7.17(VDD)
GND: C63.1 C64.1 C65.1 C66.1 C70.1 P6.3 R56.1 U7.5(VSS_2) U7.16(VSS) U7.29(EPAD)
MCLR: P6.1 R52.2 U7.26(*MCLR/VPP/RE3)
PGC: R53.2 U7.24(RB6)
PGD: R54.2 U7.25(RB7)
VBAT: R55.1 R56.2 U7.28(RA1)
NetC41_2: R55.2 ; port VBAT
NetC63_2: C63.2 R51.1 R52.1
NetC64_2: C64.2 U7.11(VUSB3V3)
NetC167_1: U7.27(RA0) ; port TEMP_OUT
NetP6_4: P6.4 R54.1
NetP6_5: P6.5 R53.1
NetU7_1: U7.1(RA2) ; port RESET
NetU7_2: U7.2(RA3) ; port INT
NetU7_3: U7.3(RA4) ; port RX0BF
NetU7_4: U7.4(RA5) ; port RX1BF
NetU7_6: U7.6(RA7) ; port TX0RTS
NetU7_7: U7.7(RA6) ; port TX1RTS
NetU7_8: U7.8(RC0) ; port TX2RTS
NetU7_9: U7.9(RC1) ; port ACC_CS
NetU7_10: U7.10(RC2) ; port CAN_CS
NetU7_18: U7.18(RB0) ; port ACC_MISO, port CAN_SO
NetU7_19: U7.19(RB1) ; port ACC_SCK, port CAN_SCK
NetU7_21: U7.21(RB3) ; port ACC_MOSI, port CAN_SI

Not connected (* = marked no-connect by the designer): U7 12(D-) 13(D+) 14(RC6) 15(RC7) 20(RB2) 22(RB4) 23(RB5)

### Notes on the sheet
- SPI data out
- SPI serial clock
- SPI data in
- (near C64) LOW ESR, CERAMIC

### Library data of the parts
C63-C66 C70 = Cap: Capacitor; Published: 8-Jun-2000; LatestRevisionDate: 17-Jul-2002; LatestRevisionNote: Re-released for DXP Platform.; PackageReference: RAD-0.3; Publisher: Altium Limited; PackageDescription: Radial Cap, Thru-Hole; 2 Leads; 0.3 in Pin Spacing
P6 = Header 5: Header, 5-Pin; LatestRevisionDate: 17-Jul-2002; LatestRevisionNote: Re-released for DXP Platform.; Publisher: Altium Limited
R51-R56 = Res1: Resistor; Published: 8-Jun-2000; LatestRevisionDate: 17-Jul-2002; LatestRevisionNote: Re-released for DXP Platform.; PackageReference: AXIAL-0.3; Publisher: Altium Limited; PackageDescription: Axial Device, Thru-Hole; 2 Leads; 0.3 in Pin Spacing
U7 = PIC18F25K50-I/ML: C: Copyright (C) 2015 Accelerated Designs. All rights reserved; Vendor: Microchip; Built_By: EMA_UL_Team; SourceLibrary: Microchip_2014-11-20; Value: PIC18F25K50-I/ML; Manufacturer_Part_Number: PIC18F25K50-I/ML

## Sheet TMP235AQDB2TQ1.SchDoc
size A
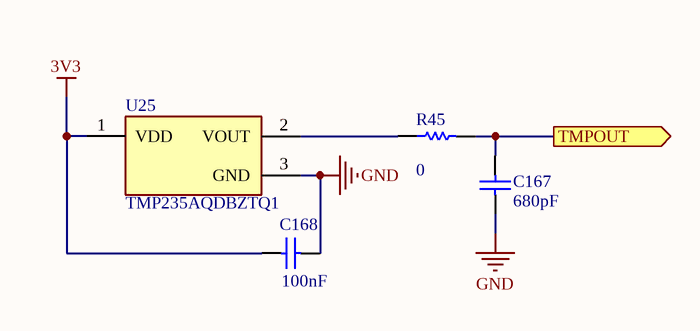
[diagram p8: TMP235AQDB2TQ1.SchDoc]

### Parts
C167  value 680pF  [0402-A]  (hidden comment: Cap)
C168  value 100nF  [0402-A]  (hidden comment: Cap)
R45  value 0  [0402-A]  (hidden comment: Res1)
U25  TMP235AQDBZTQ1  [FP-DBZ0003A-MFG]

### Ports
TMPOUT (out)

### Nets
3V3: C168.1 U25.1(VDD)
GND: C167.2 C168.2 U25.3(GND)
NetC167_1: C167.1 R45.2 ; port TMPOUT
NetR45_1: R45.1 U25.2(VOUT)

### Library data of the parts
C167 C168 = Cap: Capacitor; Published: 8-Jun-2000; LatestRevisionDate: 17-Jul-2002; LatestRevisionNote: Re-released for DXP Platform.; PackageReference: RAD-0.3; Publisher: Altium Limited; PackageDescription: Radial Cap, Thru-Hole; 2 Leads; 0.3 in Pin Spacing
R45 = Res1: Resistor; Published: 8-Jun-2000; LatestRevisionDate: 17-Jul-2002; LatestRevisionNote: Re-released for DXP Platform.; PackageReference: AXIAL-0.3; Publisher: Altium Limited; PackageDescription: Axial Device, Thru-Hole; 2 Leads; 0.3 in Pin Spacing
U25 = CMP-04948-000003-1: LOW-POWER HIGH-ACCURACY ANALOG O; Manufacturer: Texas Instruments; Manufacturer Part Number: TMP235A2DBZR; Output Current: 500uA; Operating Supply Current: 9uA; Max Supply Voltage: 5.5V; Max Junction Temp: +150°C; Accuracy: 0.5%; Min Supply Voltage: 2.3V; Standoff Height: 0.01mm; Sensor Output: Analog Voltage; Ambient Temperature Range Low: -40°C; Device Class L2: Temperature and Humidity Sensors; Digikey Description: LOW-POWER HIGH-ACCURACY ANALOG O; Lead Free: Yes; Category: IC; Device Class L3: unset; Temperature Range Low: -40°C; ComponentLink2Description: Datasheet; Package: DBZ0003A; Octopart: https://octopart.com/tmp235a2dbzr-texas+instruments-94966376; Device Class L1: Sensors; Temperature Range High: +150°C; Height: 1.12mm; Temperature: -40°C to +150°C; RoHS: TRUE; Ambient Temperature Range High: +150°C; Automotive: No; ComponentLink2URL: http://www.ti.com/lit/ds/symlink/tmp235.pdf; Mouser Description: ±2°C Analog output temperature sensor, with 10mV /°C gain 3-SOT-23 -40 to 150

## Sheet LSM6DSMTR.SchDoc
size A
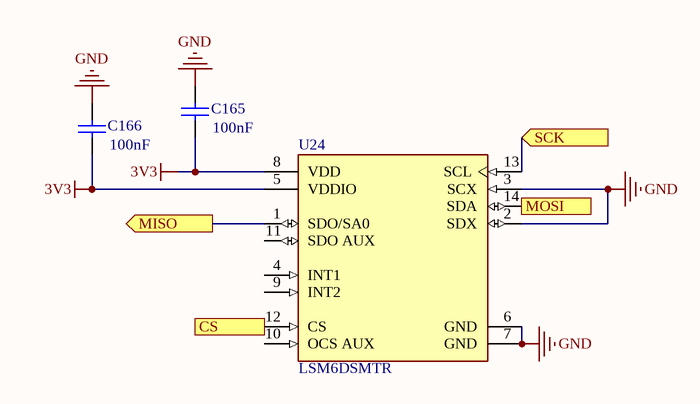
[diagram p9: LSM6DSMTR.SchDoc]

### Parts
C165  value 100nF  [0402]  (hidden comment: Cap)
C166  value 100nF  [0402]  (hidden comment: Cap)
U24  LSM6DSMTR  [FP-LGA-14L-DM00249496-MFG]

### Ports
CS (in), MISO (out), MOSI (in), SCK (in)

### Nets
3V3: C165.2 C166.2 U24.5(VDDIO) U24.8(VDD)
GND: C165.1 C166.1 U24.2(SDX) U24.3(SCX) U24.6(GND) U24.7(GND)
NetU7_9: U24.12(CS) ; port CS
NetU7_18: U24.1(SDO/SA0) ; port MISO
NetU7_19: U24.13(SCL) ; port SCK
NetU7_21: U24.14(SDA) ; port MOSI

Not connected (* = marked no-connect by the designer): U24 4(INT1) 9(INT2) 10(OCS_AUX) 11(SDO_AUX)

### Library data of the parts
C165 C166 = Cap: Capacitor; Published: 8-Jun-2000; LatestRevisionDate: 17-Jul-2002; LatestRevisionNote: Re-released for DXP Platform.; PackageReference: RAD-0.3; Publisher: Altium Limited; PackageDescription: Radial Cap, Thru-Hole; 2 Leads; 0.3 in Pin Spacing
U24 = CMP-12177-000008-1: IMU ACCEL/GYRO I2C/SPI 14LGA; Manufacturer: STMicroelectronics; Operating Supply Current: 0.29-0.65mA; Gyro Range: 125/250/500/1000/2000°/s; Sensor Output: I2C,SPI; Accel Range: 2/4/8/16g; Min Supply Voltage: 1.62V; Resolution: 16bits; Sensor Type: Temperature,Accelerometer,Gyroscope; Max Supply Voltage: 3.6V; Manufacturer Part Number: LSM6DSMTR; Octopart: https://octopart.com/lsm6dsmtr-stmicroelectronics-66358194; Height: 0.86mm; Category: IC; Lead Free: Yes; Temperature: -40°C to +85°C; Temperature Range Low: -40°C; ComponentLink2Description: Datasheet; ComponentLink2URL: https://www.st.com/resource/en/datasheet/lsm6dsm.pdf; Digikey Description: IMU ACCEL/GYRO I2C/SPI 14LGA; Footprint Url: https://www.st.com/content/ccc/resource/technical/document/technical_note/73/17/9c/16/dd/96/4a/01/CD00134799.pdf/files/CD00134799.pdf/jcr:content/translations/en.CD00134799.pdf; Device Class L1: Sensors; Device Class L2: Motion Sensors; Temperature Range High: +85°C; Mouser Description: LSM6DSM Series 3.6 V I2C/SPI 3D Accelerometer and 3D Gyroscope - LGA-14; Device Class L3: Inertial Measurement Units (IMUs); Automotive: No; Package: LGA-14L-DM00249496; RoHS: TRUE

## Sheet 5V0BUCKFINAL.SchDoc
size A
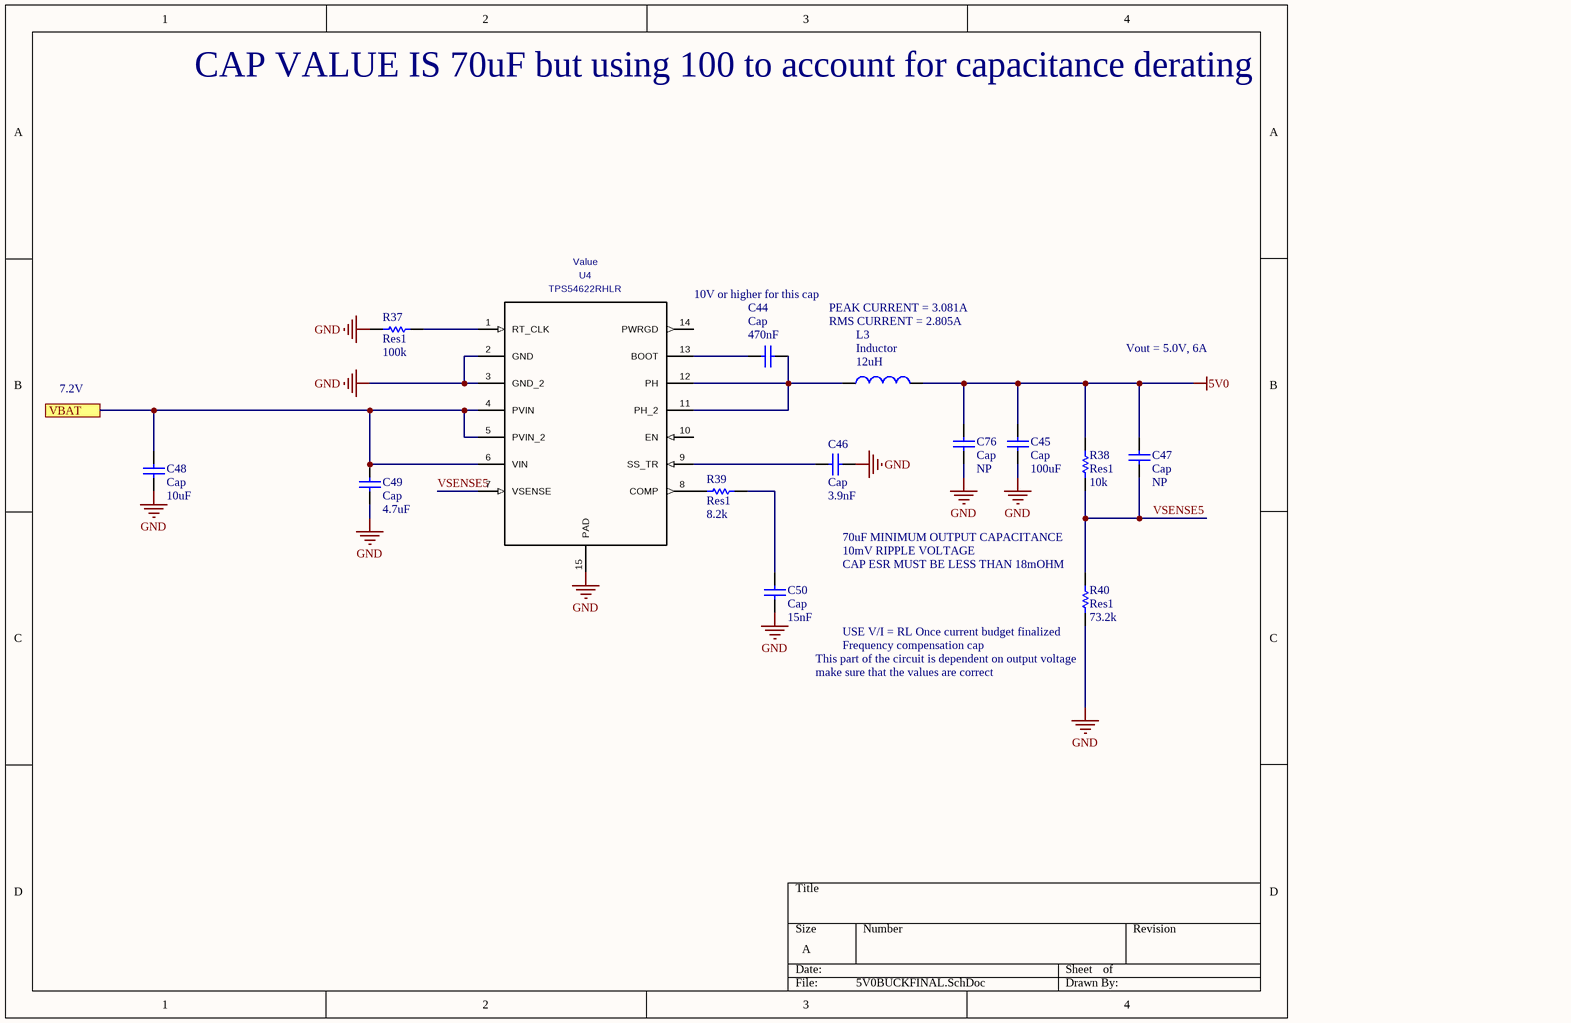
[diagram p10: 5V0BUCKFINAL.SchDoc]

### Parts
C44  Cap  value 470nF  [0402-A]
C45  Cap  value 100uF  [C1210]
C46  Cap  value 3.9nF  [0402-A]
C47  Cap  value NP  [1608[0603]]
C48  Cap  value 10uF  [6-0805_M]
C49  Cap  value 4.7uF  [6-0805_M]
C50  Cap  value 15nF  [0402-A]
C76  Cap  value NP  [1608[0603]]
L3  Inductor  value 12uH  [IND_BOURNS_SRR1260]
R37  Res1  value 100k  [0402-A]
R38  Res1  value 10k  [0402-A]
R39  Res1  value 8.2k  [0402-A]
R40  Res1  value 73.2k  [0402-A]
U4  TPS54622RHLR  [RHL0014A]

### Ports
VBAT

### Nets
5V0: C45.2 C47.2 C76.2 L3.2 R38.1
GND: C45.1 C46.1 C48.1 C49.1 C50.1 C76.1 R37.1 R40.1 U4.2(GND) U4.3(GND_2) U4.15(PAD)
VSENSE5: C47.1 R38.2 R40.2 U4.7(VSENSE)
NetC41_2: C48.2 C49.2 U4.4(PVIN) U4.5(PVIN_2) U4.6(VIN) ; port VBAT
NetC44_1: C44.1 U4.13(BOOT)
NetC44_2: C44.2 L3.1 U4.11(PH_2) U4.12(PH)
NetC46_2: C46.2 U4.9(SS_TR)
NetC50_2: C50.2 R39.1
NetR37_2: R37.2 U4.1(RT_CLK)
NetR39_2: R39.2 U4.8(COMP)

Not connected (* = marked no-connect by the designer): U4 10(EN) 14(PWRGD)

### Notes on the sheet
- CAP VALUE IS 70uF but using 100 to account for capacitance derating
- 10V or higher for this cap
- PEAK CURRENT = 3.081A
- RMS CURRENT = 2.805A
- Vout = 5.0V, 6A
- 7.2V
- 70uF MINIMUM OUTPUT CAPACITANCE
- 10mV RIPPLE VOLTAGE
- CAP ESR MUST BE LESS THAN 18mOHM
- (near R40) USE V/I = RL Once current budget finalized
- (near R40) This part of the circuit is dependent on output voltage
- make sure that the values are correct
- Frequency compensation cap

### Library data of the parts
C44-C50 C76 = Cap: Capacitor; Published: 8-Jun-2000; LatestRevisionDate: 17-Jul-2002; LatestRevisionNote: Re-released for DXP Platform.; PackageReference: RAD-0.3; Publisher: Altium Limited; PackageDescription: Radial Cap, Thru-Hole; 2 Leads; 0.3 in Pin Spacing
L3 = Inductor: Code_IEC: 1005; Published: 8-Jun-2000; LatestRevisionDate: 29-May-2009; LatestRevisionNote: IPC-7351 Footprint Added.; PackageReference: 0402-A; Publisher: Altium Limited; PackageDescription: Chip Inductor; Code_JEITA: 0402
R37-R39 = Res1: Resistor; Published: 8-Jun-2000; LatestRevisionDate: 17-Jul-2002; LatestRevisionNote: Re-released for DXP Platform.; PackageReference: AXIAL-0.3; Publisher: Altium Limited; PackageDescription: Axial Device, Thru-Hole; 2 Leads; 0.3 in Pin Spacing
R40 = Res1: Resistor 1%; Published: 8-Jun-2000; LatestRevisionDate: 17-Jul-2002; LatestRevisionNote: Re-released for DXP Platform.; PackageReference: AXIAL-0.3; Publisher: Altium Limited; PackageDescription: Axial Device, Thru-Hole; 2 Leads; 0.3 in Pin Spacing
U4 = TPS54622RHLR: as U5 on sheet 1V8BUCK; PartNumber: TPS54622RHLR; PackageReference: RHL0014A; MountType: SMT; RoHS: Y; Value: Value

## Sheet Daughter Board.SchDoc
size A
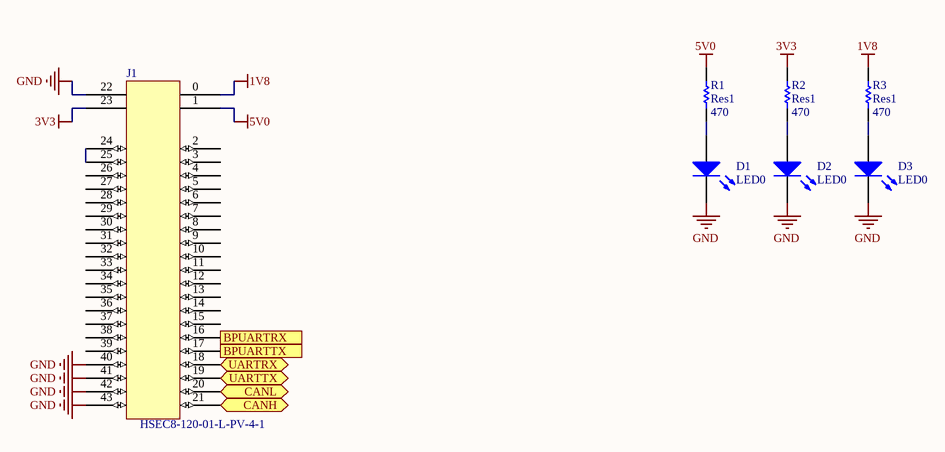
[diagram p11: Daughter Board.SchDoc]

### Parts
D1  LED0  [1608[0603]]
D2  LED0  [1608[0603]]
D3  LED0  [1608[0603]]
J1  HSEC8-120-01-L-PV-4-1  [HSEC8-120-01-L-PV-4-1 Gold Fingers]
R1  Res1  value 470  [1608[0603]]
R2  Res1  value 470  [1608[0603]]
R3  Res1  value 470  [1608[0603]]

### Ports
BPUARTRX (out), BPUARTTX (in), CANH (bidir), CANL (bidir), UARTRX (bidir), UARTTX (bidir)

### Nets
1V8: J1.0 R3.2
3V3: J1.23 R2.2
5V0: J1.1 R1.2
GND: D1.2(K) D2.2(K) D3.2(K) J1.22 J1.40 J1.41 J1.42 J1.43
NetC58_2: J1.21 ; port CANH
NetC67_2: J1.20 ; port CANL
NetD1_1: D1.1(A) R1.1
NetD2_1: D2.1(A) R2.1
NetD3_1: D3.1(A) R3.1
NetJ1_16: J1.16 ; port BPUARTRX
NetJ1_17: J1.17 ; port BPUARTTX
NetJ1_18: J1.18 ; port UARTRX
NetJ1_19: J1.19 ; port UARTTX
NetJ1_24: J1.24 J1.25

Not connected (* = marked no-connect by the designer): J1 2(0) 3(0) 4(0) 5(0) 6(0) 7(0) 8(0) 9(0) 10(0) 11(0) 12(0) 13(0) 14(0) 15(0) 26 27 28 29 30 31 32 33 34 35 36 37 38 39

### Library data of the parts
R1-R3 = Res1: Resistor; Published: 8-Jun-2000; LatestRevisionDate: 17-Jul-2002; LatestRevisionNote: Re-released for DXP Platform.; PackageReference: AXIAL-0.3; Publisher: Altium Limited; PackageDescription: Axial Device, Thru-Hole; 2 Leads; 0.3 in Pin Spacing
D1-D3 = LED0: Published: 8-Jun-2000; LatestRevisionDate: 08-Jul-2005; LatestRevisionNote: Mech Layer 1 removed.; PackageReference: LED-0; Publisher: Altium Limited; PackageDescription: LED; 2 Leads
J1 = HSEC8-120-01-L-PV-4-1: Supplier 1: Mouser

## Nets that join several sheets
1V8: 1V8BUCK (5 pins), Daughter Board (J1.0 R3.2)
3V3: 3V3BUCK (5 pins), CAN 3V3 (C71.1 C72.2 U8.3 U10.9), MCU (6 pins), TMP235AQDB2TQ1 (C168.1 U25.1), LSM6DSMTR (C165.2 C166.2 U24.5 U24.8), Daughter Board (J1.23 R2.2)
5V0: RECEIVER IC (6 pins), 5V0BUCKFINAL (5 pins), Daughter Board (J1.1 R1.2)
GND: CHARGING IC (23 pins), BALANCING IC (7 pins), 1V8BUCK (11 pins), 3V3BUCK (11 pins), CAN 3V3 (8 pins), RECEIVER IC (21 pins), MCU (10 pins), TMP235AQDB2TQ1 (C167.2 C168.2 U25.3), LSM6DSMTR (6 pins), 5V0BUCKFINAL (11 pins), Daughter Board (8 pins)
SRN: CHARGING IC (10 pins), RECEIVER IC (R16.2)
VREC: CHARGING IC (D9.1), RECEIVER IC (8 pins)
NetC41_2: CHARGING IC (F1.3 F1.4), 1V8BUCK (5 pins), 3V3BUCK (5 pins), MCU (R55.2), 5V0BUCKFINAL (5 pins)
NetC58_2: CAN 3V3 (C58.2 U8.7 U9.1), Daughter Board (J1.21)
NetC67_2: CAN 3V3 (C67.2 U8.6 U9.2), Daughter Board (J1.20)
NetC167_1: MCU (U7.27), TMP235AQDB2TQ1 (C167.1 R45.2)
NetU7_1: CAN 3V3 (U10.17), MCU (U7.1)
NetU7_2: CAN 3V3 (U10.12), MCU (U7.2)
NetU7_3: CAN 3V3 (U10.11), MCU (U7.3)
NetU7_4: CAN 3V3 (U10.10), MCU (U7.4)
NetU7_6: CAN 3V3 (U10.4), MCU (U7.6)
NetU7_7: CAN 3V3 (U10.5), MCU (U7.7)
NetU7_8: CAN 3V3 (U10.6), MCU (U7.8)
NetU7_9: MCU (U7.9), LSM6DSMTR (U24.12)
NetU7_10: CAN 3V3 (U10.16), MCU (U7.10)
NetU7_18: CAN 3V3 (U10.15), MCU (U7.18), LSM6DSMTR (U24.1)
NetU7_19: CAN 3V3 (U10.13), MCU (U7.19), LSM6DSMTR (U24.13)
NetU7_21: CAN 3V3 (U10.14), MCU (U7.21), LSM6DSMTR (U24.14)